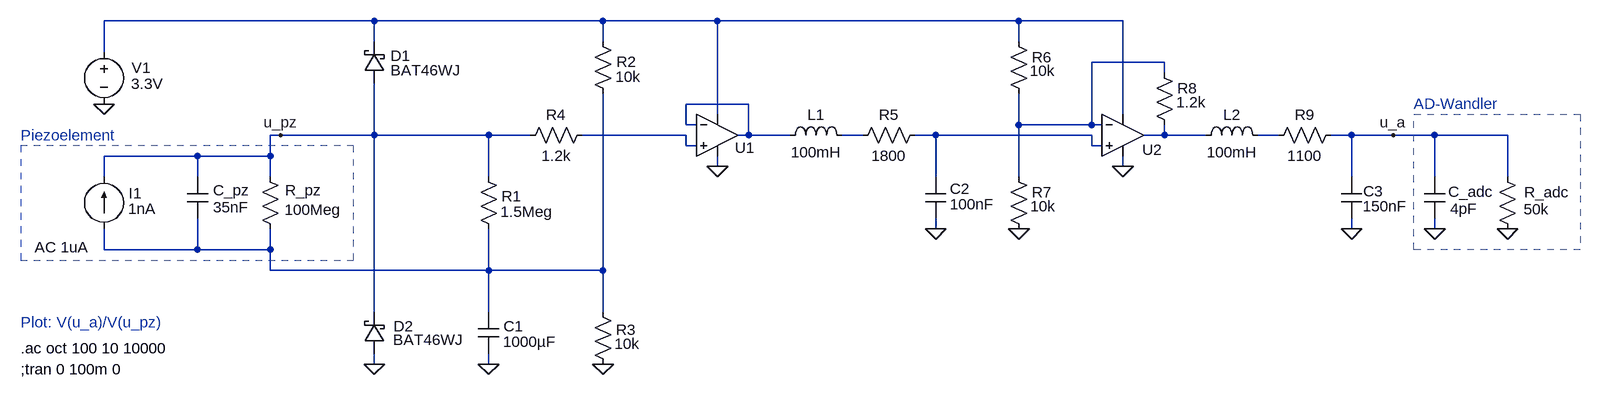
[diagram p0: schematic BA_MH_LTSpice.asc]
BA_MH_LTSpice.asc, the LTspice schematic file:
Version 4
SHEET 1 3236 1288
WIRE 32 736 -384 736
WIRE 384 736 32 736
WIRE 560 736 384 736
WIRE 1024 736 560 736
WIRE 1184 736 1024 736
WIRE 32 768 32 736
WIRE 384 768 384 736
WIRE 1024 768 1024 736
WIRE -384 784 -384 736
WIRE 1248 800 1136 800
WIRE 1248 816 1248 800
WIRE 608 864 512 864
WIRE 560 880 560 736
WIRE 1184 880 1184 736
WIRE 512 896 512 864
WIRE 528 896 512 896
WIRE 1024 896 1024 848
WIRE 1136 896 1136 800
WIRE 1136 896 1024 896
WIRE 1152 896 1136 896
WIRE -112 912 -128 912
WIRE 32 912 32 832
WIRE 32 912 -112 912
WIRE 208 912 32 912
WIRE 272 912 208 912
WIRE 512 912 352 912
WIRE 608 912 608 864
WIRE 608 912 592 912
WIRE 672 912 608 912
WIRE 784 912 752 912
WIRE 896 912 864 912
WIRE 1136 912 896 912
WIRE 1248 912 1248 896
WIRE 1248 912 1216 912
WIRE 1312 912 1248 912
WIRE 1424 912 1392 912
WIRE 1536 912 1504 912
WIRE 1600 912 1536 912
WIRE 1664 912 1600 912
WIRE 1776 912 1664 912
WIRE 512 928 512 912
WIRE 528 928 512 928
WIRE 1136 928 1136 912
WIRE 1152 928 1136 928
WIRE -240 944 -384 944
WIRE -128 944 -128 912
WIRE -128 944 -240 944
WIRE 560 960 560 944
WIRE 1184 960 1184 944
WIRE -384 976 -384 944
WIRE -240 976 -240 944
WIRE -128 976 -128 944
WIRE 208 976 208 912
WIRE 896 976 896 912
WIRE 1024 976 1024 896
WIRE 1536 976 1536 912
WIRE 1664 976 1664 912
WIRE 1776 976 1776 912
WIRE 896 1056 896 1040
WIRE 1536 1056 1536 1040
WIRE 1664 1056 1664 1040
WIRE -384 1088 -384 1056
WIRE -240 1088 -240 1040
WIRE -240 1088 -384 1088
WIRE -128 1088 -128 1056
WIRE -128 1088 -240 1088
WIRE -128 1120 -128 1088
WIRE 208 1120 208 1056
WIRE 208 1120 -128 1120
WIRE 384 1120 384 848
WIRE 384 1120 208 1120
WIRE 32 1184 32 912
WIRE 208 1184 208 1120
WIRE 384 1184 384 1120
WIRE 32 1264 32 1248
WIRE 208 1264 208 1248
FLAG 1184 960 0
FLAG -384 864 0
FLAG 1536 1056 0
FLAG -112 912 u_pz
FLAG 1600 912 u_a
FLAG 208 1264 0
FLAG 384 1264 0
FLAG 32 1264 0
FLAG 560 960 0
FLAG 896 1056 0
FLAG 1024 1056 0
FLAG 1664 1056 0
FLAG 1776 1056 0
SYMBOL res 1760 960 R0
WINDOW 3 41 66 Left 2
WINDOW 0 42 40 Left 2
SYMATTR Value 50k
SYMATTR InstName R_adc
SYMBOL cap 1648 976 R0
WINDOW 0 37 23 Left 2
WINDOW 3 40 49 Left 2
SYMATTR InstName C_adc
SYMATTR Value 4pF
SYMBOL cap 880 976 R0
WINDOW 0 38 18 Left 2
WINDOW 3 38 42 Left 2
SYMATTR InstName C2
SYMATTR Value 100nF
SYMBOL ind 656 928 R270
WINDOW 0 32 56 VTop 2
WINDOW 3 5 56 VBottom 2
SYMATTR InstName L1
SYMATTR Value 100mH
SYMBOL res 880 896 R90
WINDOW 0 0 56 VBottom 2
WINDOW 3 32 56 VTop 2
SYMATTR InstName R5
SYMATTR Value 1800
SYMBOL OpAmps\\UniversalOpamp 1184 912 R0
WINDOW 0 30 22 Left 2
SYMATTR InstName U2
SYMBOL voltage -384 768 R0
WINDOW 123 0 0 Left 0
WINDOW 39 0 0 Left 0
WINDOW 0 43 40 Left 2
WINDOW 3 42 65 Left 2
SYMATTR InstName V1
SYMATTR Value 3.3V
SYMBOL cap 1520 976 R0
WINDOW 0 34 22 Left 2
WINDOW 3 33 45 Left 2
SYMATTR InstName C3
SYMATTR Value 150nF
SYMBOL ind 1296 928 R270
WINDOW 0 32 56 VTop 2
WINDOW 3 5 56 VBottom 2
SYMATTR InstName L2
SYMATTR Value 100mH
SYMBOL res 1520 896 R90
WINDOW 0 0 56 VBottom 2
WINDOW 3 32 56 VTop 2
SYMATTR InstName R9
SYMATTR Value 1100
SYMBOL res 368 752 R0
WINDOW 0 37 47 Left 2
WINDOW 3 35 70 Left 2
SYMATTR InstName R2
SYMATTR Value 10k
SYMBOL res 368 1168 R0
WINDOW 0 36 43 Left 2
WINDOW 3 34 65 Left 2
SYMATTR InstName R3
SYMATTR Value 10k
SYMBOL OpAmps\\UniversalOpamp 560 912 R0
WINDOW 0 27 19 Left 2
SYMATTR InstName U1
SYMBOL res 1008 960 R0
WINDOW 3 34 61 Left 2
SYMATTR Value 10k
SYMATTR InstName R7
SYMBOL res 1232 800 R0
WINDOW 3 34 61 Left 2
SYMATTR Value 1.2k
SYMATTR InstName R8
SYMBOL res 1008 752 R0
WINDOW 3 33 61 Left 2
SYMATTR Value 10k
SYMATTR InstName R6
SYMBOL cap 192 1184 R0
WINDOW 0 39 22 Left 2
WINDOW 3 38 46 Left 2
SYMATTR InstName C1
SYMATTR Value 1000µF
SYMBOL current -384 1056 R180
WINDOW 0 -58 55 Left 2
WINDOW 3 -80 31 Left 2
WINDOW 123 24 -28 Left 2
WINDOW 39 0 0 Left 0
SYMATTR InstName I1
SYMATTR Value 1nA
SYMATTR Value2 AC 1uA
SYMBOL res -144 960 R0
WINDOW 0 39 37 Left 2
WINDOW 3 38 67 Left 2
SYMATTR InstName R_pz
SYMATTR Value 100Meg
SYMBOL cap -256 976 R0
WINDOW 0 40 21 Left 2
WINDOW 3 40 47 Left 2
SYMATTR InstName C_pz
SYMATTR Value 35nF
SYMBOL schottky 48 832 R180
WINDOW 0 -9 42 Right 2
WINDOW 3 -9 20 Right 2
SYMATTR InstName D1
SYMATTR Value BAT46WJ
SYMATTR Description Diode
SYMATTR Type diode
SYMBOL schottky 48 1248 R180
WINDOW 0 -14 42 Right 2
WINDOW 3 -13 21 Right 2
SYMATTR InstName D2
SYMATTR Value BAT46WJ
SYMATTR Description Diode
SYMATTR Type diode
SYMBOL res 192 960 R0
WINDOW 0 36 46 Left 2
WINDOW 3 34 70 Left 2
SYMATTR InstName R1
SYMATTR Value 1.5Meg
SYMBOL res 368 896 R90
WINDOW 0 0 56 VBottom 2
WINDOW 3 32 56 VTop 2
SYMATTR InstName R4
SYMATTR Value 1.2k
TEXT -512 1240 Left 2 !.ac oct 100 10 10000
TEXT -512 1272 Left 2 !;tran 0 100m 0
TEXT -512 912 Left 2 ;Piezoelement
TEXT 1632 864 Left 2 ;AD-Wandler
TEXT -512 1200 Left 2 ;Plot: V(u_a)/V(u_pz)
RECTANGLE Normal 0 928 -512 1104 2
RECTANGLE Normal 1888 1088 1632 880 2

The netlist it stands for:
* BA_MH_LTSpice.asc
R_adc u_a 0 50k
C_adc u_a 0 4pF
C2 N006 0 100nF
L1 N003 N005 100mH
R5 N006 N005 1800
XU2 N006 N002 N001 0 N007 level1 Avol=1Meg GBW=10Meg Vos=0 En=0 Enk=0 In=0 Ink=0 Rin=500Meg  ; pins In+ In- V+ V- OUT
V1 N001 0 3.3V
C3 u_a 0 150nF
L2 N007 N008 100mH
R9 u_a N008 1100
R2 N001 N009 10k
R3 N009 0 10k
XU1 N004 N003 N001 0 N003 level1 Avol=1Meg GBW=10Meg Vos=0 En=0 Enk=0 In=0 Ink=0 Rin=500Meg  ; pins In+ In- V+ V- OUT
R7 N002 0 10k
R8 N002 N007 1.2k
R6 N001 N002 10k
C1 N009 0 1000µF
I1 N009 u_pz 1nA AC 1uA
R_pz u_pz N009 100Meg
C_pz u_pz N009 35nF
D1 u_pz N001 BAT46WJ
D2 0 u_pz BAT46WJ
R1 u_pz N009 1.5Meg
R4 N004 u_pz 1.2k
.model D D
.lib standard.dio
.ac oct 100 10 10000
;tran 0 100m 0
* Piezoelement
* AD-Wandler
* Plot: V(u_a)/V(u_pz)
.lib UniversalOpAmp1.lib
.backanno
.end